# Altium project loicpinuela.PrjPcb
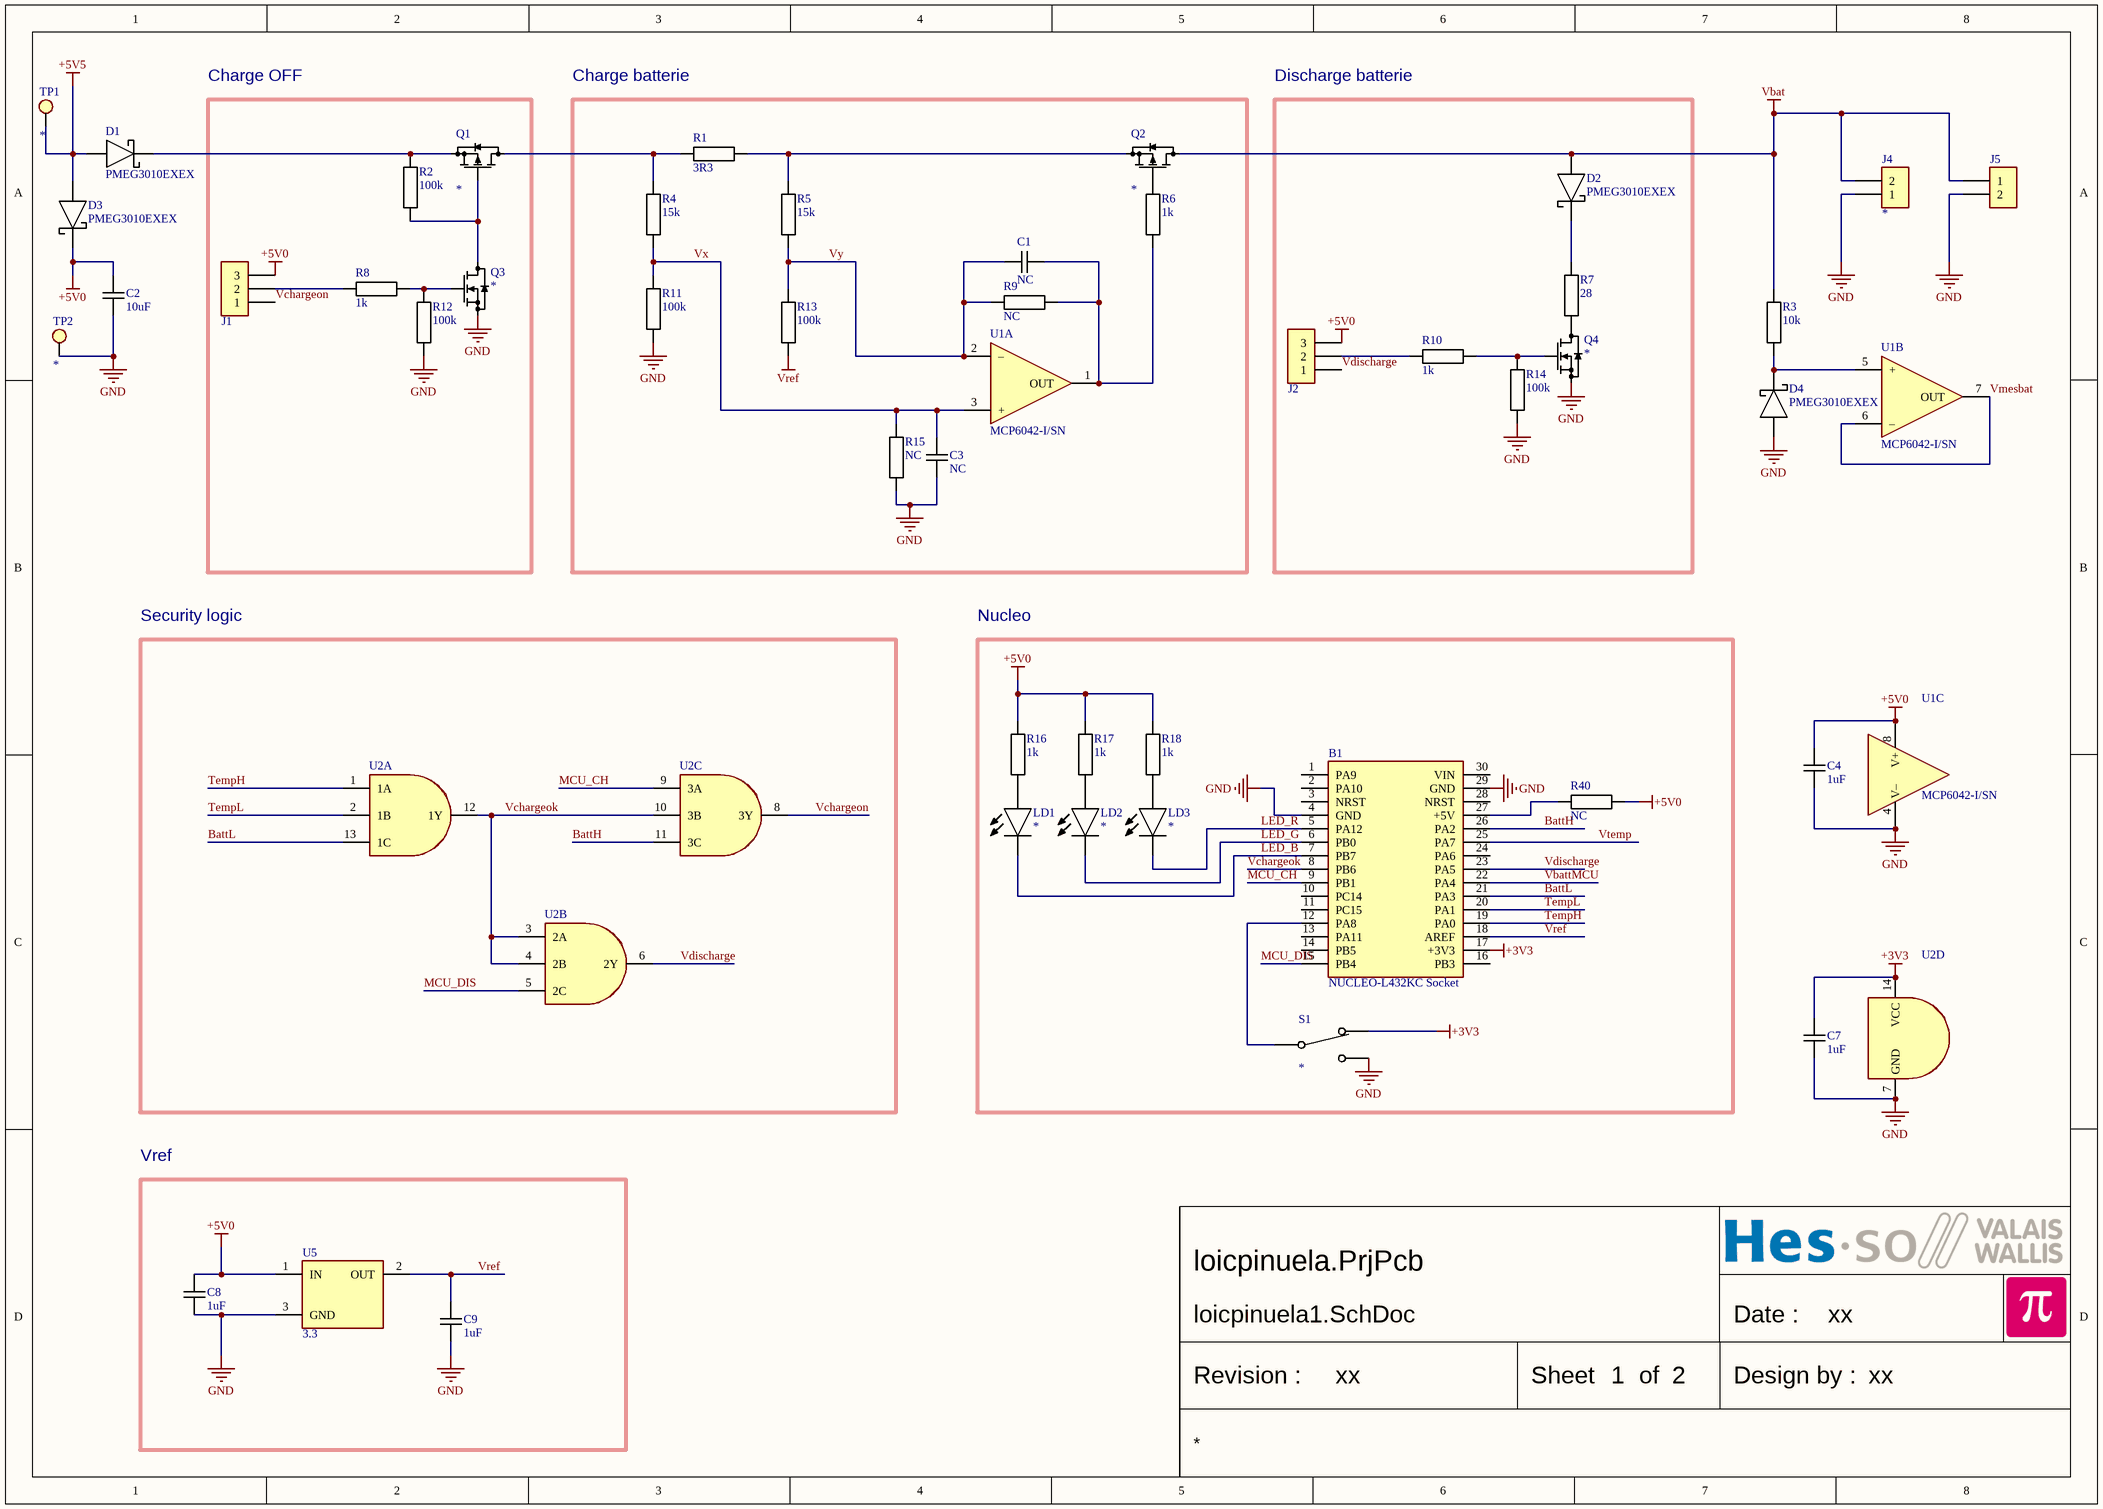
[diagram p0: loicpinuela1.SchDoc]
PcbDate: xx; PcbDesigner: xx; PcbRevision: xx; SchematicDate: xx; SchematicDesigner: xx; SchematicRevision: xx
2 sheets, 79 parts. Net scope: global (net labels, ports and power ports of the same name join across sheets).
Board file: loicpinuela.PcbDoc
Sheets:
  loicpinuela1.SchDoc
  loicpinuela2.SchDoc

## Sheet loicpinuela1.SchDoc
size A3; SheetNumber: 1; SheetTotal: 2

### Parts
B1  NUCLEO-L432KC Socket  [NUCLEO-L432KC Socket]
C1  NC  [CAPACITOR 2012 REFLOW]
C2  10uF  [CAPACITOR 2012 REFLOW]
C3  NC  [CAPACITOR 2012 REFLOW]
C4  1uF  [CAPACITOR 2012 REFLOW]
C7  1uF  [CAPACITOR 2012 REFLOW]
C8  1uF  [CAPACITOR 2012 REFLOW]
C9  1uF  [CAPACITOR 2012 REFLOW]
D1  PMEG3010EXEX  [DIODE SOD123-FL REFLOW]
D2  PMEG3010EXEX  [DIODE SOD123-FL REFLOW]
D3  PMEG3010EXEX  [DIODE SOD123-FL REFLOW]
D4  PMEG3010EXEX  [DIODE SOD123-FL REFLOW]
J1  *  [PinHeader1x3 P2.54]  (value not drawn)
J2  *  [PinHeader1x3 P2.54]  (value not drawn)
J4  *  [WE 691411810002]
J5  (no value)  [Socket1x2 P2.54]
LD1  *  [LED 3216 REFLOW]
LD2  *  [LED 3216 REFLOW]
LD3  *  [LED 3216 REFLOW]
Q1  *  [SOT23 P0.95 C1.6x3.0 H1.3]
Q2  *  [SOT23 P0.95 C1.6x3.0 H1.3]
Q3  *  [SOT23 P0.95 C1.6x3.0 H1.3]
Q4  *  [SOT23 P0.95 C1.6x3.0 H1.3]
R1  3R3  [RESISTOR 2012 REFLOW]
R2  100k  [RESISTOR 2012 REFLOW]
R3  10k  [RESISTOR 2012 REFLOW]
R4  15k  [RESISTOR 2012 REFLOW]
R5  15k  [RESISTOR 2012 REFLOW]
R6  1k  [RESISTOR 2012 REFLOW]
R7  28  [RESISTOR 2012 REFLOW]
R8  1k  [RESISTOR 2012 REFLOW]
R9  NC  [RESISTOR 2012 REFLOW]
R10  1k  [RESISTOR 2012 REFLOW]
R11  100k  [RESISTOR 2012 REFLOW]
R12  100k  [RESISTOR 2012 REFLOW]
R13  100k  [RESISTOR 2012 REFLOW]
R14  100k  [RESISTOR 2012 REFLOW]
R15  NC  [RESISTOR 2012 REFLOW]
R16  1k  [RESISTOR 2012 REFLOW]
R17  1k  [RESISTOR 2012 REFLOW]
R18  1k  [RESISTOR 2012 REFLOW]
R40  NC  [RESISTOR 2012 REFLOW]
S1  *  [SLIDE SWITCH Knitter MFP120]
TP1  *  [Hole 0.8 D1.5]  (no BOM)
TP2  *  [Hole 0.8 D1.5]  (no BOM)
U1  MCP6042-I/SN  [SO8 P1.27 C4.0X5.0 H1.75]  (parts A,B,C of 3)
U2  (no value)  [SO14 P1.27 C4.0X8.8 H1.75]  (parts A,B,C,D of 4)
U5  3.3  [SOT23 P0.95 C1.6x3.0 H1.3]

### Blocks framed on the sheet
Charge OFF: J1 Q1 Q3 R2 R8 R12
Charge batterie: C1 C3 Q2 R1 R4-R6 R9 R11 R13 R15 U1
Discharge batterie: D2 J2 Q4 R7 R10 R14
Security logic: U2
Nucleo: B1 LD1-LD3 R16-R18 R40 S1
Vref: C8 C9 U5

### Nets
+3V3: B1.17(+3V3) C7.2 S1.1(NC) U2.14(VCC)
+5V0: C2.2 C4.2 C8.2 D3.1(C) J1.3 J2.3 R16.2 R17.2 R18.2 R40.1 U1.8(V+) U5.1(IN)
+5V5: D1.2(A) D3.2(A) TP1.1
GND: B1.4(GND) B1.29(GND) C2.1 C3.1 C4.1 C7.1 C8.1 C9.1 D4.2(A) J4.1 J5.2 Q3.2(S) Q4.2(S) R11.1 R12.1 R14.1 R15.1 S1.3(NO) TP2.1 U1.4(V–) U2.7(GND) U5.3(GND)
Vbat: D2.2(A) J4.2 J5.1 Q2.3(D) R3.2
Vmesbat: U1.6(–) U1.7(OUT)
Vref: B1.18(AREF) C9.2 R13.1 U5.2(OUT)
Vtemp: B1.25(PA7)
BattH: B1.26(PA2) U2.11(3C)
BattL: B1.21(PA3) U2.13(1C)
LED_B: B1.7(PB7) LD1.1(C)
LED_G: B1.6(PB0) LD2.1(C)
LED_R: B1.5(PA12) LD3.1(C)
MCU_CH: B1.9(PB1) U2.9(3A)
MCU_DIS: B1.15(PB4) U2.5(2C)
TempH: B1.19(PA0) U2.1(1A)
TempL: B1.20(PA1) U2.2(1B)
VbattMCU: B1.22(PA4)
Vchargeok: B1.8(PB6) U2.3(2A) U2.4(2B) U2.10(3B) U2.12(1Y)
Vchargeon: J1.1 U2.8(3Y)
Vdischarge: B1.23(PA5) J2.1 U2.6(2Y)
Vx: C3.2 R4.1 R11.2 R15.2 U1.3(+)
Vy: C1.2 R5.1 R9.2 R13.2 U1.2(–)
NetB1_12: B1.12(PA8) S1.2(com)
NetB1_27: B1.27(+5V) R40.2
NetC1_1: C1.1 R6.1 R9.1 U1.1(OUT)
NetD1_1: D1.1(C) Q1.2(S) R2.2
NetD2_1: D2.1(C) R7.2
NetD4_1: D4.1(C) R3.1 U1.5(+)
NetJ1_2: J1.2 R8.1
NetJ2_2: J2.2 R10.1
NetLD1_2: LD1.2(A) R16.1
NetLD2_2: LD2.2(A) R17.1
NetLD3_2: LD3.2(A) R18.1
NetQ1_1: Q1.1(G) Q3.3(D) R2.1
NetQ1_3: Q1.3(D) R1.1 R4.2
NetQ2_1: Q2.1(G) R6.2
NetQ2_2: Q2.2(S) R1.2 R5.2
NetQ3_1: Q3.1(G) R8.2 R12.2
NetQ4_1: Q4.1(G) R10.2 R14.2
NetQ4_3: Q4.3(D) R7.1

Not connected (* = marked no-connect by the designer): B1 1(PA9) 2(PA10) 3(NRST) 10(PC14) 11(PC15) 13(PA11) 14(PB5) 16(PB3) 24(PA6) 28(NRST) 30(VIN)

### Notes on the sheet
- Date :
- Revision :
- Sheet
- of
- Design by :

### Library data of the parts
B1 = NUCLEO-L432KC Socket: ARM Cortex based board; Value: NUCLEO-L432KC Socket
C1-C4 C7-C9 = Capacitor
  C1 C3: Value: NC
  C2: Value: 10uF
  C4 C7-C9: Value: 1uF
D1-D4 = DIODE SCHOTTKY: Diode Schottky generic 2 Leads; Value: PMEG3010EXEX
J1 J2 = PinHeader1x3: Plug connector; Value: *
J4 = Header2: PCB terminal block; Value: *
J5 = Socket1x2: Receptacle connector
LD1-LD3 = LED: LED generic; Value: *
Q1 Q2 = MOS-P SOT23 G-S-D: Generic MOS-P; Value: *
Q3 Q4 = MOS-N SOT23 G-S-D: Generic MOS-N; Value: *
R1 R9 R15 R40 = Resistor
  R1: Value: 3R3
  R9 R15 R40: Value: NC
R2-R8 R10-R14 R16-R18 = Resistor: Tolerance: 1%
  R2 R11-R14: Value: 100k
  R3: Value: 10k
  R4 R5: Value: 15k
  R6 R8 R10 R16-R18: Value: 1k
  R7: Value: 28
S1 = Slide Switch 1Pole ON-ON: Value: *
TP1 TP2 = Hole: Value: *
U1 = OPA DUAL: Generic dual OPA 8 pins; Value: MCP6042-I/SN
U2 = GATE AND 3X  TRIPLE INPUT 14P
U5 = REFERENCE SOT23 IN,OUT,GND: Generic Positive Voltage Reference; Value: 3.3

## Sheet loicpinuela2.SchDoc
size A3; SheetNumber: 2; SheetTotal: 2
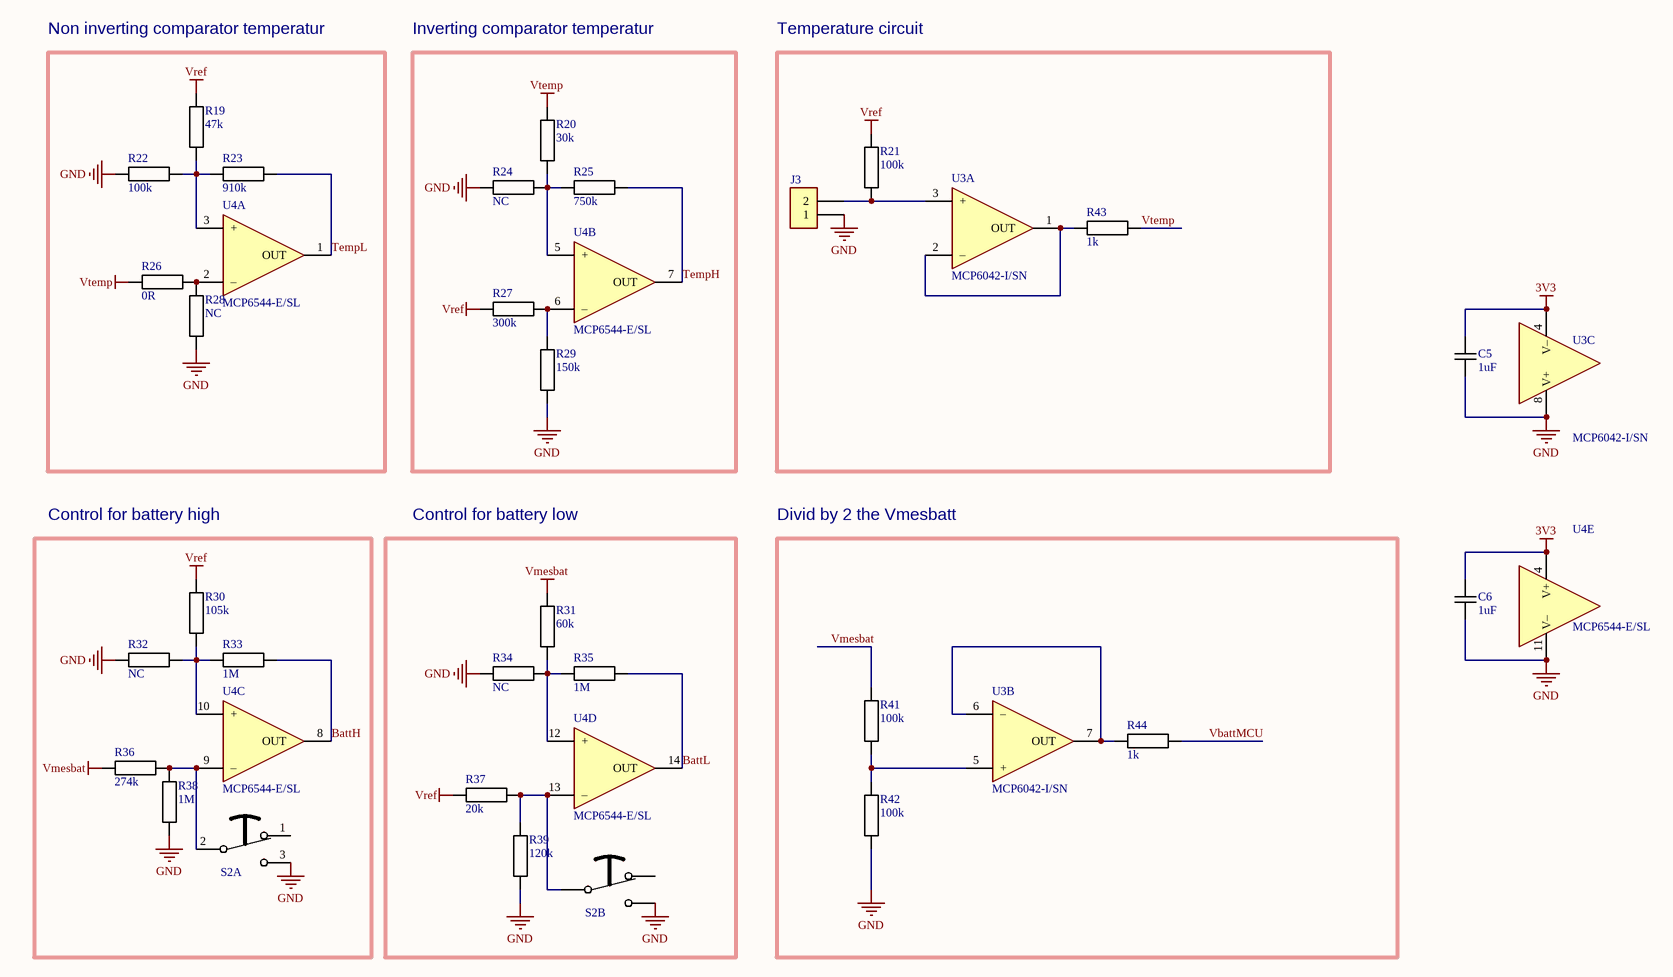
[diagram p1: loicpinuela2.SchDoc]

### Parts
C5  1uF  [CAPACITOR 2012 REFLOW]
C6  1uF  [CAPACITOR 2012 REFLOW]
J3  (no value)  [Socket1x2 P2.54]
R19  47k  [RESISTOR 2012 REFLOW]
R20  30k  [RESISTOR 2012 REFLOW]
R21  100k  [RESISTOR 2012 REFLOW]
R22  100k  [RESISTOR 2012 REFLOW]
R23  910k  [RESISTOR 2012 REFLOW]
R24  NC  [RESISTOR 2012 REFLOW]
R25  750k  [RESISTOR 2012 REFLOW]
R26  0R  [RESISTOR 2012 REFLOW]
R27  300k  [RESISTOR 2012 REFLOW]
R28  NC  [RESISTOR 2012 REFLOW]
R29  150k  [RESISTOR 2012 REFLOW]
R30  105k  [RESISTOR 2012 REFLOW]
R31  60k  [RESISTOR 2012 REFLOW]
R32  NC  [RESISTOR 2012 REFLOW]
R33  1M  [RESISTOR 2012 REFLOW]
R34  NC  [RESISTOR 2012 REFLOW]
R35  1M  [RESISTOR 2012 REFLOW]
R36  274k  [RESISTOR 2012 REFLOW]
R37  20k  [RESISTOR 2012 REFLOW]
R38  1M  [RESISTOR 2012 REFLOW]
R39  120k  [RESISTOR 2012 REFLOW]
R41  100k  [RESISTOR 2012 REFLOW]
R42  100k  [RESISTOR 2012 REFLOW]
R43  1k  [RESISTOR 2012 REFLOW]
R44  1k  [RESISTOR 2012 REFLOW]
S2  *  [Push Button E-Switch TL2233]  (value not drawn)  (parts A,B of 2)
U3  MCP6042-I/SN  [SO8 P1.27 C4.0X5.0 H1.75]  (parts A,B,C of 3)
U4  MCP6544-E/SL  [SO14 P1.27 C4.0X8.8 H1.75]  (parts A,B,C,D,E of 5)

### Blocks framed on the sheet
Non inverting comparator temperatur: R19 R22 R23 R26 R28 U4
Inverting comparator temperatur: R20 R24 R25 R27 R29 U4
Temperature circuit: J3 R21 R43 U3
Control for battery high: R30 R32 R33 R36 R38 S2 U4
Control for battery low: R31 R34 R35 R37 R39 S2 U4
Divid by 2 the Vmesbatt: R41 R42 R44 U3

### Nets
3V3: C5.2 C6.2 U3.4(V–) U4.4(V+)
GND: C5.1 C6.1 J3.1 R22.1 R24.1 R28.1 R29.2 R32.1 R34.1 R38.1 R39.2 R42.1 S2.3(NO1) S2.4(NO2) U3.8(V+) U4.11(V–)
Vmesbat: R31.2 R36.1 R41.2
Vref: R19.2 R21.2 R27.1 R30.2 R37.1
Vtemp: R20.2 R26.1 R43.2
BattH: R33.2 U4.8(OUT)
BattL: R35.2 U4.14(OUT)
TempH: R25.2 U4.7(OUT)
TempL: R23.2 U4.1(OUT)
VbattMCU: R44.2
NetJ3_2: J3.2 R21.1 U3.3(+)
NetR19_1: R19.1 R22.2 R23.1 U4.3(+)
NetR20_1: R20.1 R24.2 R25.1 U4.5(+)
NetR26_2: R26.2 R28.2 U4.2(–)
NetR27_2: R27.2 R29.1 U4.6(–)
NetR30_1: R30.1 R32.2 R33.1 U4.10(+)
NetR31_1: R31.1 R34.2 R35.1 U4.12(+)
NetR36_2: R36.2 R38.2 S2.2(COM1) U4.9(–)
NetR37_2: R37.2 R39.1 S2.5(COM2) U4.13(–)
NetR41_1: R41.1 R42.2 U3.5(+)
NetR43_1: R43.1 U3.1(OUT) U3.2(–)
NetR44_1: R44.1 U3.6(–) U3.7(OUT)

Not connected (* = marked no-connect by the designer): S2 1(NC1) 6(NC2)

### Notes on the sheet
- Date :
- Revision :
- Sheet
- of
- Design by :

### Library data of the parts
C5 C6 = Capacitor: Value: 1uF
J3 = Socket1x2: Receptacle connector
R19-R39 R41-R44 = Resistor: Tolerance: 1%
  R19: Value: 47k
  R20: Value: 30k
  R21 R22 R41 R42: Value: 100k
  R23: Value: 910k
  R24 R28 R32 R34: Value: NC
  R25: Value: 750k
  R26: Value: 0R
  R27: Value: 300k
  R29: Value: 150k
  R30: Value: 105k
  R31: Value: 60k
  R33 R35 R38: Value: 1M
  R36: Value: 274k
  R37: Value: 20k
  R39: Value: 120k
  R43 R44: Value: 1k
S2 = Push Button E-Switch TL2233: Pushbutton, DPDT, SMD Switch; Value: *
U3 = OPA DUAL: Generic dual OPA 8 pins; Value: MCP6042-I/SN
U4 = COMPARATOR QUAD OUT PIN 1-7-8-14: Generic quad comparator 14 pins, Outpout PIN 1-7-18-14; Value: MCP6544-E/SL

## Nets that join several sheets
GND: loicpinuela1 (22 pins), loicpinuela2 (16 pins)
Vmesbat: loicpinuela1 (U1.6 U1.7), loicpinuela2 (R31.2 R36.1 R41.2)
Vref: loicpinuela1 (B1.18 C9.2 R13.1 U5.2), loicpinuela2 (5 pins)
Vtemp: loicpinuela1 (B1.25), loicpinuela2 (R20.2 R26.1 R43.2)
BattH: loicpinuela1 (B1.26 U2.11), loicpinuela2 (R33.2 U4.8)
BattL: loicpinuela1 (B1.21 U2.13), loicpinuela2 (R35.2 U4.14)
TempH: loicpinuela1 (B1.19 U2.1), loicpinuela2 (R25.2 U4.7)
TempL: loicpinuela1 (B1.20 U2.2), loicpinuela2 (R23.2 U4.1)
VbattMCU: loicpinuela1 (B1.22), loicpinuela2 (R44.2)